# Altium schematic sheet 1_Schematic - OSSM Wireless V0.4.schdoc
size 1635 x 568 mm
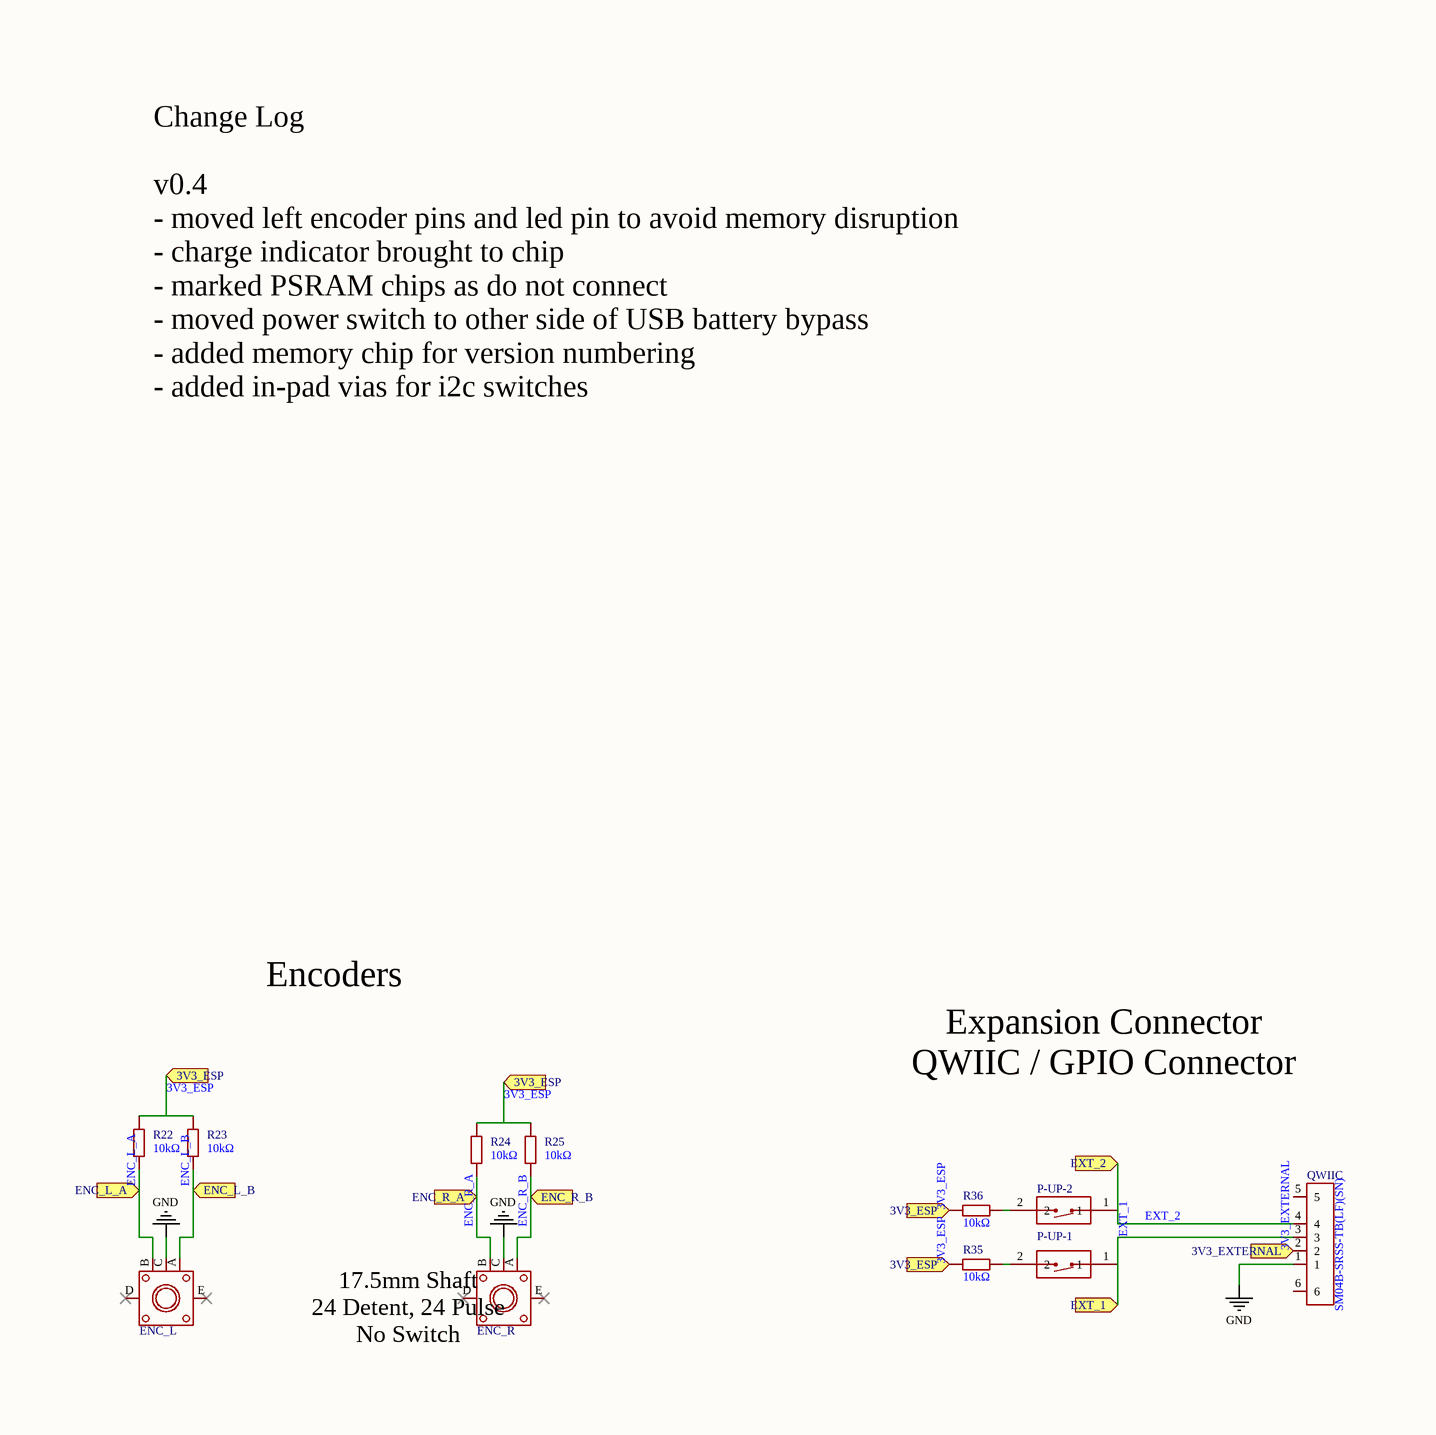
[diagram p0: 1_Schematic - OSSM Wireless V0.4.schdoc, top left]
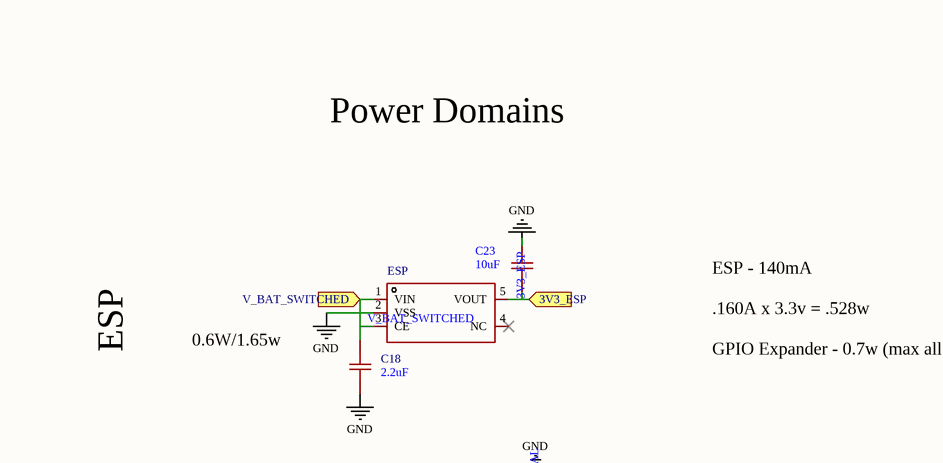
[diagram p1: 1_Schematic - OSSM Wireless V0.4.schdoc, top middle]
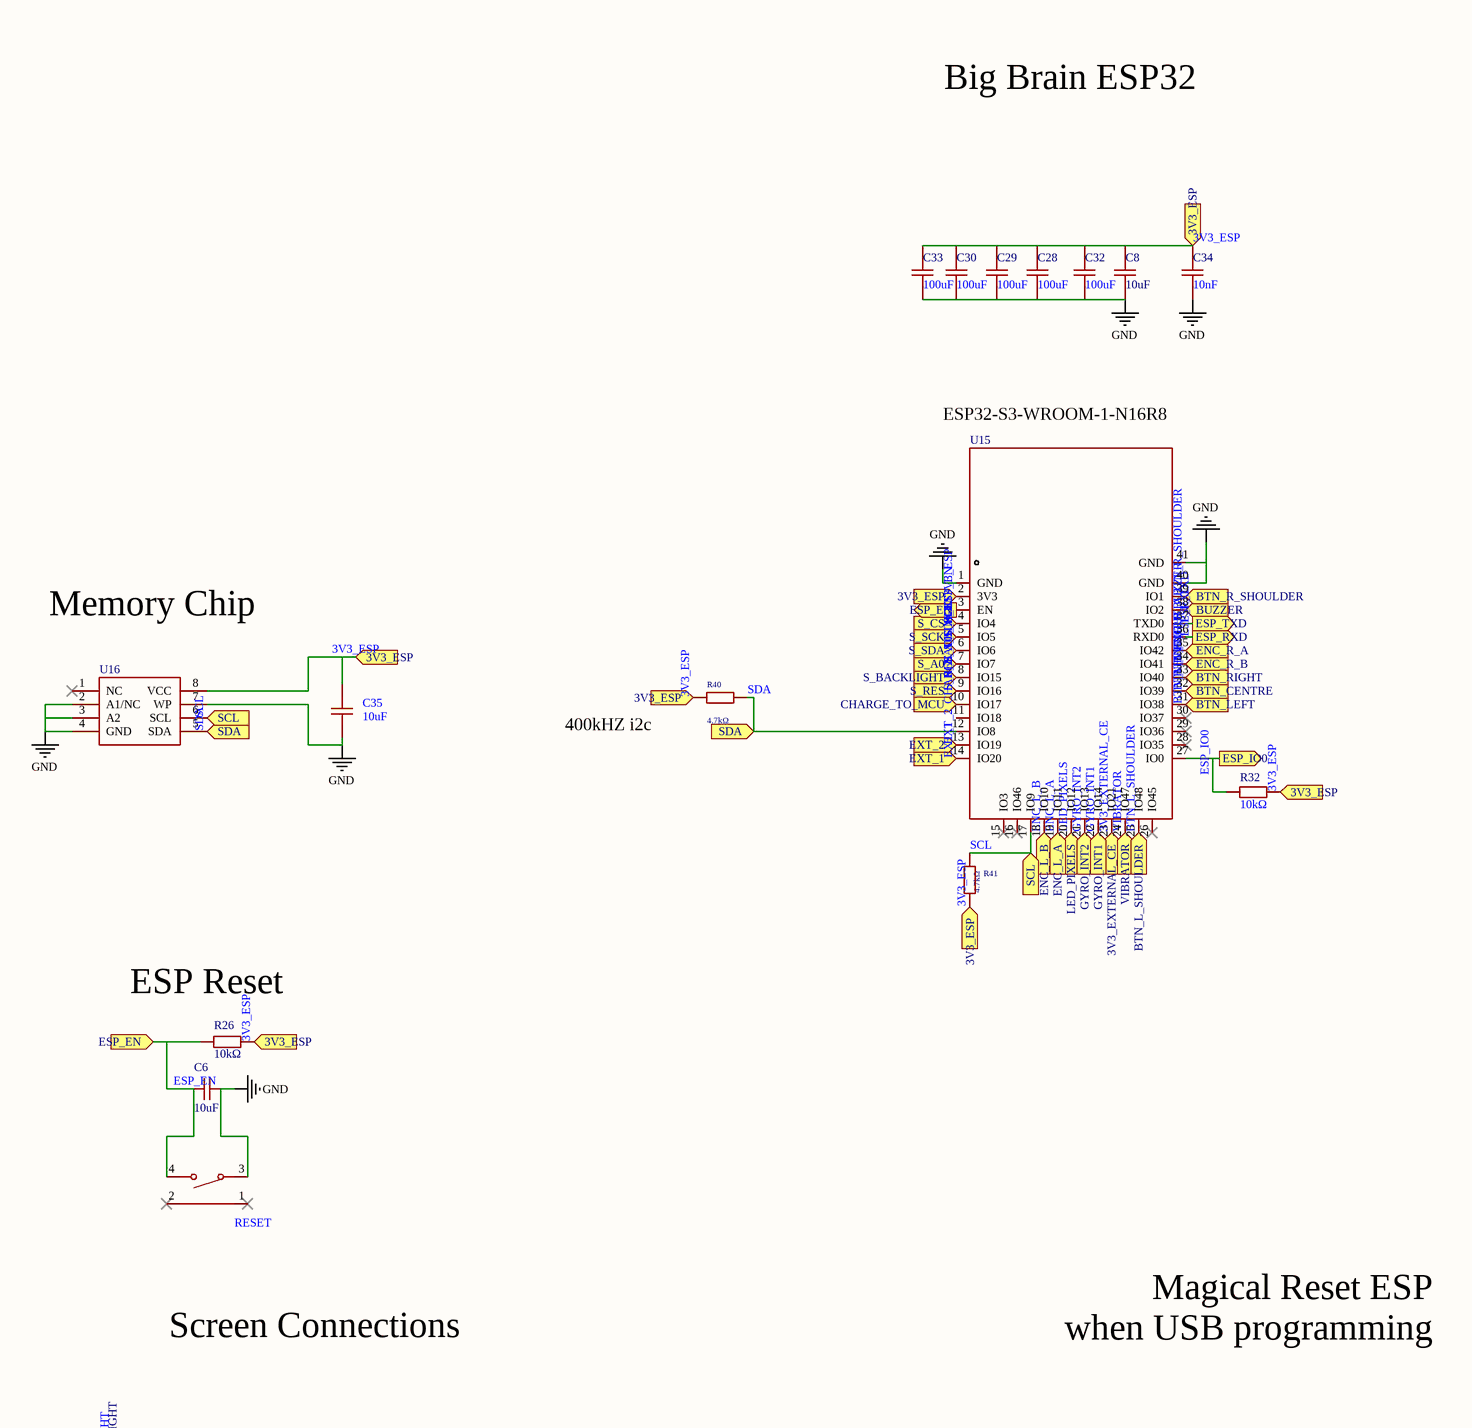
[diagram p2: 1_Schematic - OSSM Wireless V0.4.schdoc, top right]
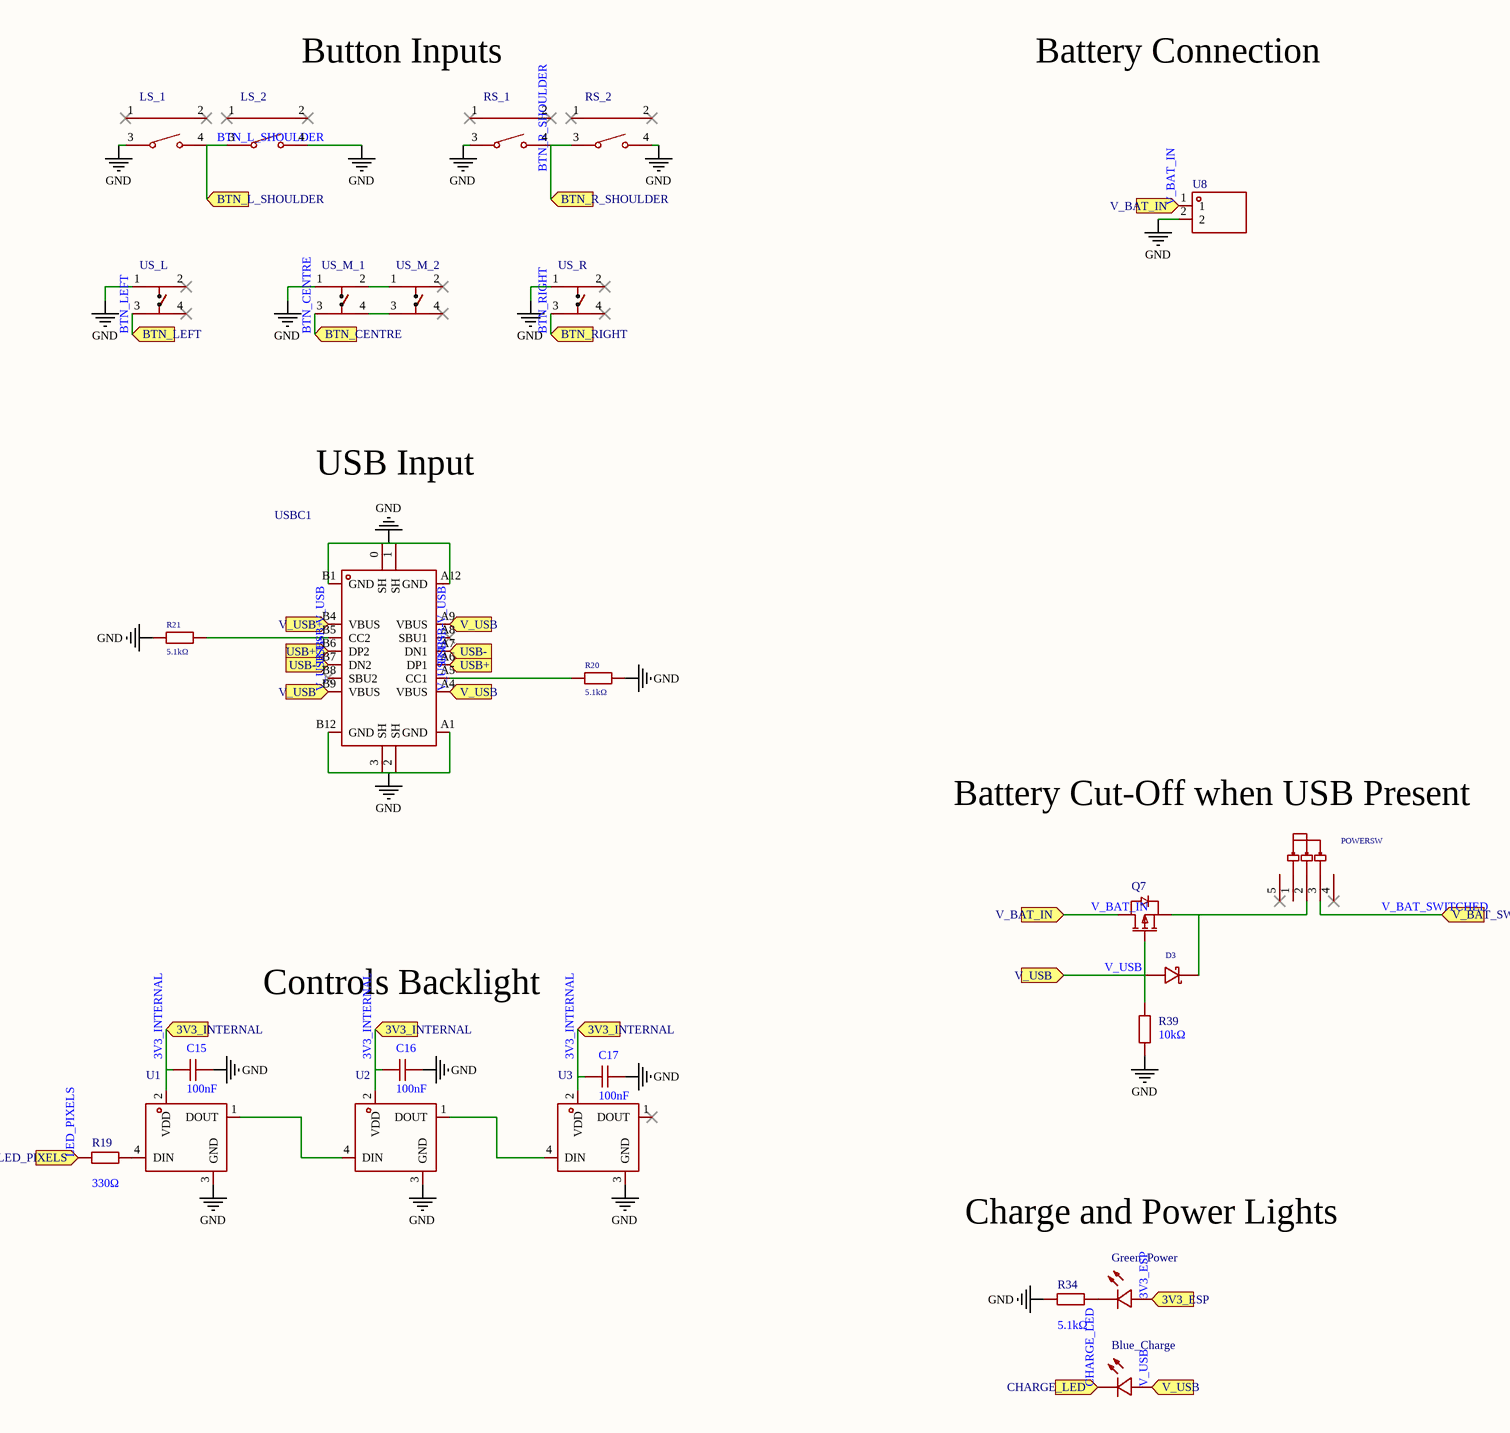
[diagram p3: 1_Schematic - OSSM Wireless V0.4.schdoc, bottom left]
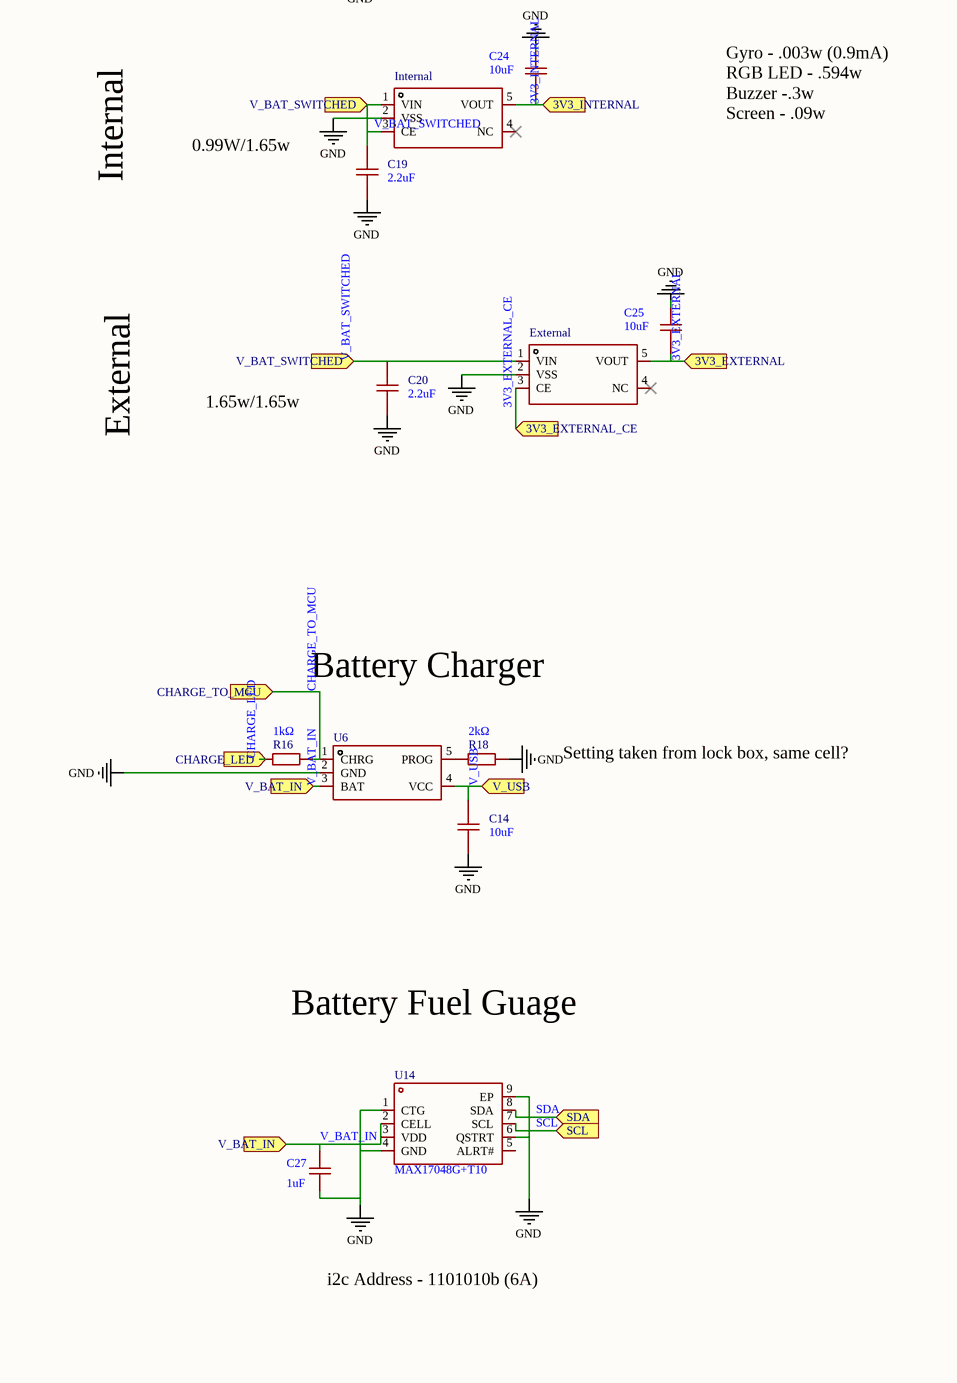
[diagram p4: 1_Schematic - OSSM Wireless V0.4.schdoc, bottom middle]
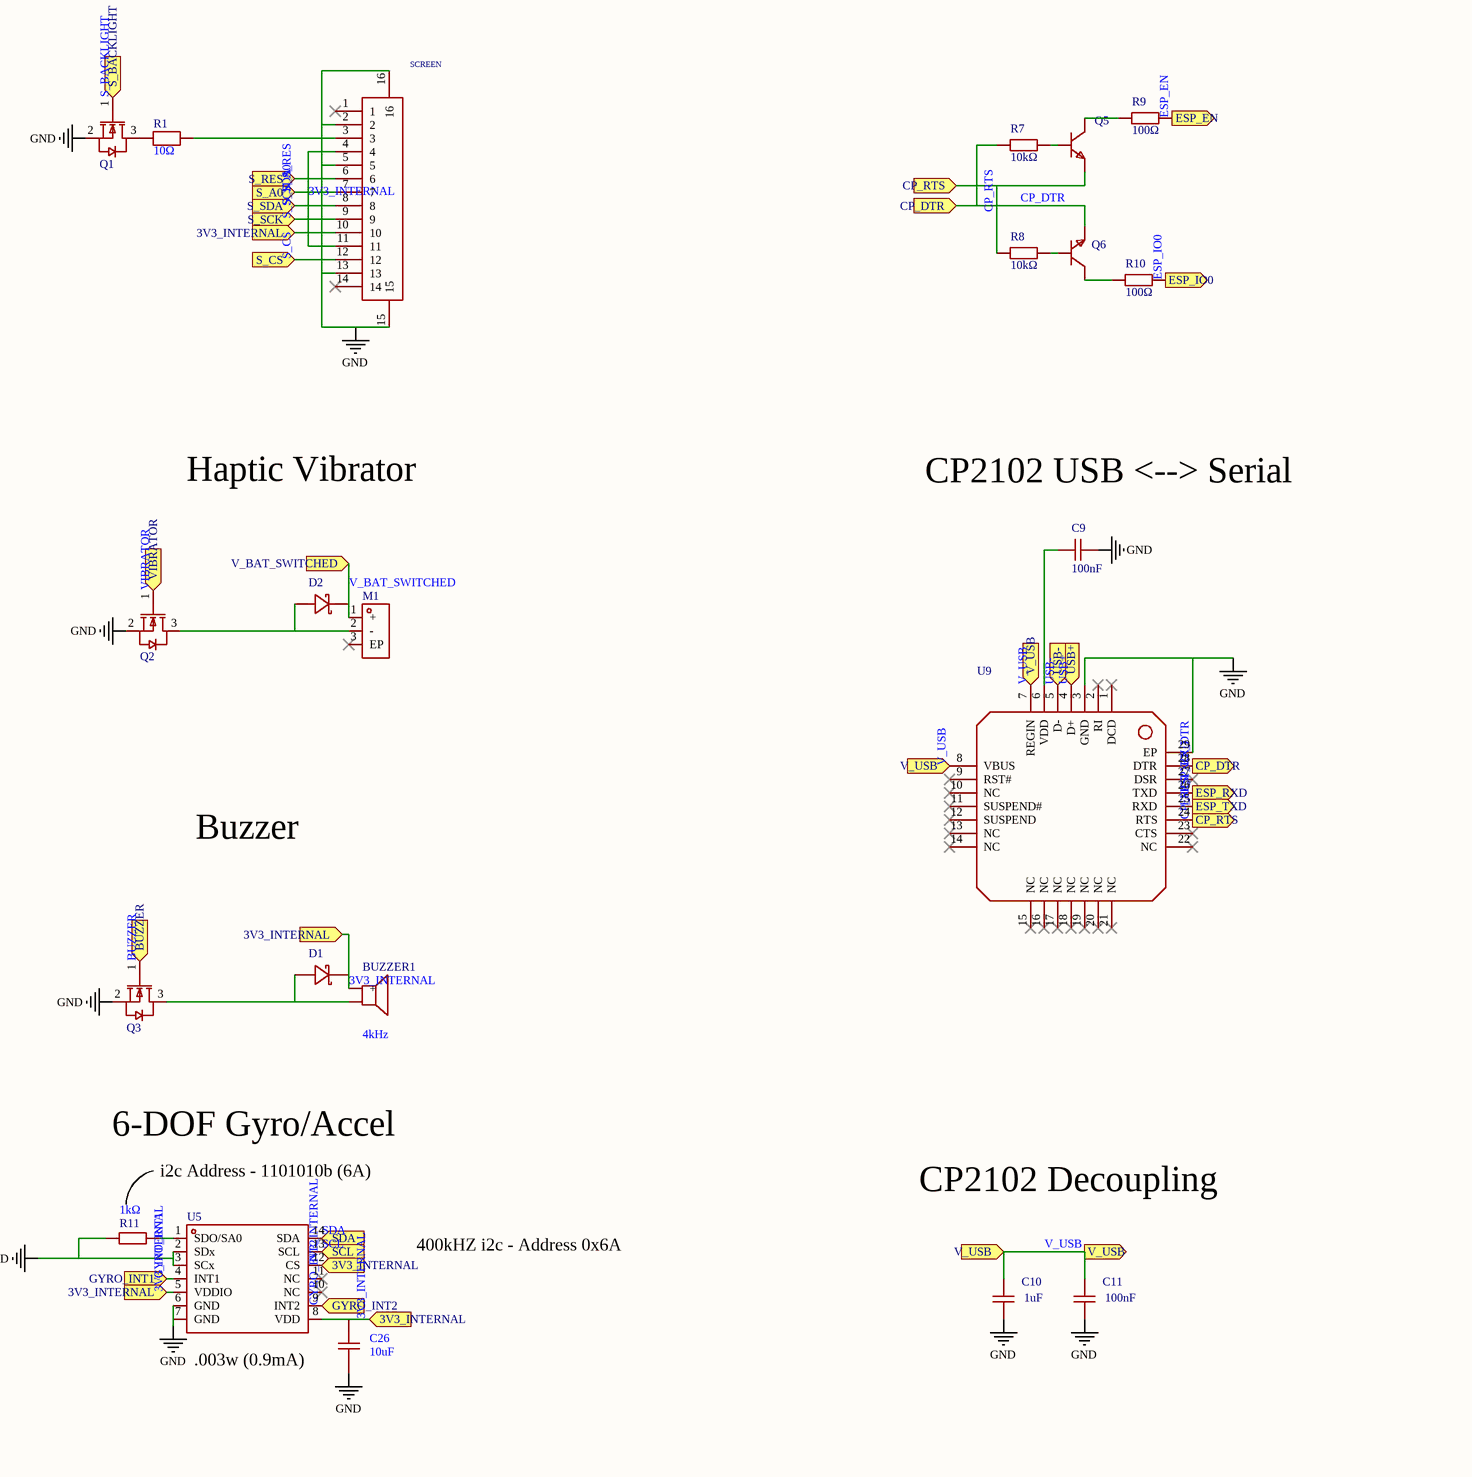
[diagram p5: 1_Schematic - OSSM Wireless V0.4.schdoc, bottom right]

## Parts
Blue_Charge  TJ-S1706SW6TGLC6B-A5  [LED-SMD_L1.7-W0.6-RD]  (value not drawn)
BUZZER1  4kHz  [BUZ-SMD_L4.0-W4.0-P3.50-L]
C6  value 10uF  [C0402]
C8  value 10uF  [C0402]
C9  100nF  [C0402]
C10  1uF  [C0402]
C11  100nF  [C0402]
C14  10uF  [C0402]
C15  100nF  [C0402]
C16  100nF  [C0402]
C17  100nF  [C0402]
C18  2.2uF  [C0402]
C19  2.2uF  [C0402]
C20  2.2uF  [C0402]
C23  value 10uF  [C0402]
C24  value 10uF  [C0402]
C25  value 10uF  [C0402]
C26  value 10uF  [C0402]
C27  1uF  [C0402]
C28  100uF  [C1206]
C29  100uF  [C1206]
C30  100uF  [C1206]
C32  100uF  [C1206]
C33  100uF  [C1206]
C34  10nF  [C0402]
C35  value 10uF  [C0402]
D1  B5819W  [SOD-123F_L2.7-W1.6-LS3.8-RD-1]  (value not drawn)
D2  B5819W  [SOD-123F_L2.7-W1.6-LS3.8-RD-1]  (value not drawn)
D3  B5819W-TP  [SOD-123_L2.8-W1.8-LS3.7-RD]  (value not drawn)
ENC_L  EC12E24204A8  [SW-TH_EC12EXXXX]  (value not drawn)
ENC_R  EC12E24204A8  [SW-TH_EC12EXXXX]  (value not drawn)
ESP  ME6211C33M5G-N  [SOT-23-5_L3.0-W1.7-P0.95-LS2.8-BL]  (value not drawn)
External  ME6211C33M5G-N  [SOT-23-5_L3.0-W1.7-P0.95-LS2.8-BL]  (value not drawn)
Green_Power  TJ-S1706SW6TGLC2G-A5  [LED-SMD_L1.7-W0.6-RD]  (value not drawn)
Internal  ME6211C33M5G-N  [SOT-23-5_L3.0-W1.7-P0.95-LS2.8-BL]  (value not drawn)
LS_1  TS24CA  [SW-SMD_TS24CA]  (value not drawn)
LS_2  TS24CA  [SW-SMD_TS24CA]  (value not drawn)
M1  Z3OC1T8219731  [VIBRATING-MOTOR-SMD_3P-C9900001680]  (value not drawn)
P-UP-1  2.54-1P TPGT  [SW-SMD_2P-L6.2-W2.5-LS9.4]  (value not drawn)
P-UP-2  2.54-1P TPGT  [SW-SMD_2P-L6.2-W2.5-LS9.4]  (value not drawn)
POWERSW  SK12D07VG5  [SW-TH_SK12D07VG5]  (value not drawn)
Q1  AO3400  [SOT-23_L2.9-W1.3-P1.90-LS2.4-BR]  (value not drawn)
Q2  AO3400  [SOT-23_L2.9-W1.3-P1.90-LS2.4-BR]  (value not drawn)
Q3  AO3400  [SOT-23_L2.9-W1.3-P1.90-LS2.4-BR]  (value not drawn)
Q5  (no value)  [SOT-23-3_L2.9-W1.3-P1.90-LS2.4-BR]
Q6  (no value)  [SOT-23-3_L2.9-W1.3-P1.90-LS2.4-BR]
Q7  SI2301  [SOT-23-3_L2.9-W1.4-P1.91-LS2.6-BR]  (value not drawn)
QWIIC  SM04B-SRSS-TB(LF)(SN)  [CONN-SMD_4P-P1.00_SM04B-SRSS-TB-LF-SN]
R1  10Ω  [R0603]
R7  value 10kΩ  [R0402]
R8  value 10kΩ  [R0402]
R9  100Ω  [R0402]
R10  100Ω  [R0402]
R11  1kΩ  [R0402]
R16  1kΩ  [R0402]
R18  2kΩ  [R0402]
R19  330Ω  [R0402]
R20  5.1kΩ  [R0402]
R21  5.1kΩ  [R0402]
R22  10kΩ  [R0402]
R23  10kΩ  [R0402]
R24  10kΩ  [R0402]
R25  10kΩ  [R0402]
R26  value 10kΩ  [R0402]
R32  10kΩ  [R0402]
R34  5.1kΩ  [R0402]
R35  10kΩ  [R0402]
R36  10kΩ  [R0402]
R39  10kΩ  [R0402]
R40  4.7kΩ  [R0402]
R41  4.7kΩ  [R0402]
RESET  TS24CA  [SW-SMD_TS24CA]  (value not drawn)
RS_1  TS24CA  [SW-SMD_TS24CA]  (value not drawn)
RS_2  TS24CA  [SW-SMD_TS24CA]  (value not drawn)
SCREEN  AFC01-S14FCA-00  [FPC-SMD_AFC01-S14FCA-00]  (value not drawn)
U1  XL-1010RGBC-WS2812B  [LED-SMD_4P-L1.0-W1.0-TL_XL-1010RGBC-WS2812B]  (value not drawn)
U2  XL-1010RGBC-WS2812B  [LED-SMD_4P-L1.0-W1.0-TL_XL-1010RGBC-WS2812B]  (value not drawn)
U3  XL-1010RGBC-WS2812B  [LED-SMD_4P-L1.0-W1.0-TL_XL-1010RGBC-WS2812B]  (value not drawn)
U5  LSM6DS3TR-C  [LGA-14_L3.0-W2.5-P0.50-TL]  (value not drawn)
U6  TP4054-42-SOT25R  [SOT-23-5_L3.0-W1.7-P0.95-LS2.8-BL]  (value not drawn)
U8  S2B-PH-K(LF)(SN)  [CONN-TH_S2B-PH-K-LF-SN]  (value not drawn)
U9  (no value)  [WQFN-28_L5.0-W5.0-P0.50-BL-EP3.2]
U14  MAX17048G+T10  [DFN-8_L2.0-W2.0-P0.50-BL-EP]
U15  ESP32-S3-WROOM-1-N16R8  [WIRELM-SMD_ESP32-S3-WROOM-1]  (value not drawn)
U16  AT24C04C-SSHM-T  [SOIC-8_L5.0-W4.0-P1.27-LS6.0-BL]  (value not drawn)
US_L  TC-6610-9-260G  [SW-TH_4P-L5.0-W5.0-P4.50-LS6.5]  (value not drawn)
US_M_1  TC-6610-9-260G  [SW-TH_4P-L5.0-W5.0-P4.50-LS6.5]  (value not drawn)
US_M_2  TC-6610-9-260G  [SW-TH_4P-L5.0-W5.0-P4.50-LS6.5]  (value not drawn)
US_R  TC-6610-9-260G  [SW-TH_4P-L5.0-W5.0-P4.50-LS6.5]  (value not drawn)
USBC1  TYPE-C-31-M-12  [USB-C_SMD-TYPE-C-31-M-12]  (value not drawn)

## Ports
3V3_ESP (in), 3V3_EXTERNAL (in), 3V3_EXTERNAL_CE (in), 3V3_INTERNAL (in), BTN_CENTRE (in), BTN_L_SHOULDER (in), BTN_LEFT (in), BTN_R_SHOULDER (in), BTN_RIGHT (in), BUZZER (in), CHARGE_LED (in), CHARGE_TO_MCU (in), CP_DTR (in), CP_DTR (out), CP_RTS (in), CP_RTS (out), ENC_L_A (in), ENC_L_B (in), ENC_R_A (in), ENC_R_B (in), ESP_EN (in), ESP_EN (out), ESP_IO0 (out), ESP_RXD (out), ESP_TXD (out), EXT_1 (in), EXT_2 (in), GYRO_INT1 (in), GYRO_INT2 (in), LED_PIXELS (in), S_A0 (in), S_BACKLIGHT (in), S_CS (in), S_RES (in), S_SCK (in), S_SDA (in), SCL (in), SDA (in), USB+ (in), USB- (in), V_BAT_IN (in), V_BAT_SWITCHED (in), V_USB (in), V_USB (out), VIBRATOR (in)

## Nets
GND: C6.2 C8.1 C9.1 C10.1 C11.1 C14.1 C15.2 C16.2 C17.2 C18.2 C19.2 C20.2 C23.1 C24.1 C25.1 C26.1 C27.1 C28.1 C29.1 C30.1 C32.1 C33.1 C34.1 C35.1 ENC_L.C ENC_R.C ESP.2(VSS) External.2(VSS) Internal.2(VSS) LS_1.3 LS_2.4 Q1.2(S) Q2.2(S) Q3.2(S) QWIIC.1 R11.1 R18.2 R20.2 R21.2 R34.1 R39.2 RESET.3 RS_1.3 RS_2.4 SCREEN.2 SCREEN.5 SCREEN.13 SCREEN.15 SCREEN.16 U1.3(GND) U2.3(GND) U3.3(GND) U5.2(SDx) U5.3(SCx) U5.6(GND) U5.7(GND) U6.2(GND) U8.2 U9.3(GND) U9.29(EP) U14.1(CTG) U14.4(GND) U14.6(QSTRT) U14.9(EP) U15.1(GND) U15.40(GND) U15.41(GND) U16.2(A1/NC) U16.3(A2) U16.4(GND) U16.7(WP) US_L.1 US_M_1.1 US_R.1 USBC1.0(SH) USBC1.1(SH) USBC1.2(SH) USBC1.3(SH) USBC1.A1(GND) USBC1.A12(GND) USBC1.B1(GND) USBC1.B12(GND)
3V3_ESP: C8.2 C23.2 C28.2 C29.2 C30.2 C32.2 C33.2 C34.2 C35.2 ESP.5(VOUT) Green_Power.2 R22.1 R23.1 R24.1 R25.1 R26.2 R32.2 R35.2 R36.2 R40.1 R41.1 U15.2(3V3) U16.8(VCC) ; port 3V3_ESP
3V3_EXTERNAL: C25.2 External.5(VOUT) QWIIC.2 ; port 3V3_EXTERNAL
3V3_EXTERNAL_CE: External.3(CE) U15.23(IO21) ; port 3V3_EXTERNAL_CE
3V3_INTERNAL: BUZZER1.1(+) C15.1 C16.1 C17.1 C24.2 C26.2 D1.1(K) Internal.5(VOUT) SCREEN.4 SCREEN.10 SCREEN.11 U1.2(VDD) U2.2(VDD) U3.2(VDD) U5.5(VDDIO) U5.8(VDD) U5.12(CS) ; port 3V3_INTERNAL
BTN_CENTRE: U15.32(IO39) US_M_1.3 ; port BTN_CENTRE
BTN_L_SHOULDER: LS_1.4 LS_2.3 U15.25(IO48) ; port BTN_L_SHOULDER
BTN_LEFT: U15.31(IO38) US_L.3 ; port BTN_LEFT
BTN_R_SHOULDER: RS_1.4 RS_2.3 U15.39(IO1) ; port BTN_R_SHOULDER
BTN_RIGHT: U15.33(IO40) US_R.3 ; port BTN_RIGHT
BUZZER: Q3.1(G) U15.38(IO2) ; port BUZZER
CHARGE_LED: Blue_Charge.1 R16.1 ; port CHARGE_LED
CHARGE_TO_MCU: R16.2 U6.1(CHRG) U15.10(IO17) ; port CHARGE_TO_MCU
CP_DTR: Q6.2(E) R7.1 U9.28(DTR) ; port CP_DTR
CP_RTS: Q5.2(E) R8.1 U9.24(RTS) ; port CP_RTS
ENC_L_A: ENC_L.B R22.2 U15.19(IO11) ; port ENC_L_A
ENC_L_B: ENC_L.A R23.2 U15.18(IO10) ; port ENC_L_B
ENC_R_A: ENC_R.B R24.2 U15.35(IO42) ; port ENC_R_A
ENC_R_B: ENC_R.A R25.2 U15.34(IO41) ; port ENC_R_B
ESP_EN: C6.1 R9.2 R26.1 RESET.4 U15.3(EN) ; port ESP_EN
ESP_IO0: R10.2 R32.1 U15.27(IO0) ; port ESP_IO0
ESP_RXD: U9.26(TXD) U15.36(RXD0) ; port ESP_RXD
ESP_TXD: U9.25(RXD) U15.37(TXD0) ; port ESP_TXD
EXT_1: P-UP-1.1 QWIIC.3 U15.14(IO20) ; port EXT_1
EXT_2: P-UP-2.1 QWIIC.4 U15.13(IO19) ; port EXT_2
GYRO_INT1: U5.4(INT1) U15.22(IO14) ; port GYRO_INT1
GYRO_INT2: U5.9(INT2) U15.21(IO13) ; port GYRO_INT2
LED_PIXELS: R19.1 U15.20(IO12) ; port LED_PIXELS
S_A0: SCREEN.7 U15.7(IO7) ; port S_A0
S_BACKLIGHT: Q1.1(G) U15.8(IO15) ; port S_BACKLIGHT
S_CS: SCREEN.12 U15.4(IO4) ; port S_CS
S_RES: SCREEN.6 U15.9(IO16) ; port S_RES
S_SCK: SCREEN.9 U15.5(IO5) ; port S_SCK
S_SDA: SCREEN.8 U15.6(IO6) ; port S_SDA
SCL: R41.2 U5.13(SCL) U14.7(SCL) U15.17(IO9) U16.6(SCL) ; port SCL
SDA: R40.2 U5.14(SDA) U14.8(SDA) U15.12(IO8) U16.5(SDA) ; port SDA
USB+: U9.4(D+) USBC1.A6(DP1) USBC1.B6(DP2) ; port USB+
USB-: U9.5(D-) USBC1.A7(DN1) USBC1.B7(DN2) ; port USB-
V_BAT_IN: C27.2 Q7.3(D) U6.3(BAT) U8.1 U14.2(CELL) U14.3(VDD) ; port V_BAT_IN
V_BAT_SWITCHED: C18.1 C19.1 C20.1 D2.1(K) ESP.1(VIN) ESP.3(CE) External.1(VIN) Internal.1(VIN) Internal.3(CE) M1.1(+) POWERSW.3 ; port V_BAT_SWITCHED
V_USB: Blue_Charge.2 C10.2 C11.2 C14.2 D3.2(A) Q7.1(G) R39.1 U6.4(VCC) U9.7(REGIN) U9.8(VBUS) USBC1.A4(VBUS) USBC1.A9(VBUS) USBC1.B4(VBUS) USBC1.B9(VBUS) ; port V_USB
VIBRATOR: Q2.1(G) U15.24(IO47) ; port VIBRATOR
NetBUZZER1_2: BUZZER1.2 D1.2(A) Q3.3(D)
NetC9_2: C9.2 U9.6(VDD)
NetD2_2: D2.2(A) M1.2(-) Q2.3(D)
NetD3_1: D3.1(C) POWERSW.2 Q7.2(S)
NetGreen_Power_1: Green_Power.1 R34.2
NetP-UP-1_2: P-UP-1.2 R35.1
NetP-UP-2_2: P-UP-2.2 R36.1
NetQ1_3: Q1.3(D) R1.1
NetQ5_1: Q5.1(B) R7.2
NetQ5_3: Q5.3(C) R9.1
NetQ6_1: Q6.1(B) R8.2
NetQ6_3: Q6.3(C) R10.1
NetR1_2: R1.2 SCREEN.3
NetR11_2: R11.2 U5.1(SDO/SA0)
NetR18_1: R18.1 U6.5(PROG)
NetR19_2: R19.2 U1.4(DIN)
NetR20_1: R20.1 USBC1.A5(CC1)
NetR21_1: R21.1 USBC1.B5(CC2)
NetU1_1: U1.1(DOUT) U2.4(DIN)
NetU2_1: U2.1(DOUT) U3.4(DIN)
NetUS_M_1_2: US_M_1.2 US_M_2.1
NetUS_M_1_4: US_M_1.4 US_M_2.3

Not connected (* = marked no-connect by the designer): ENC_L D* E*; ENC_R D* E*; ESP 4(NC)*; External 4(NC)*; Internal 4(NC)*; LS_1 1* 2*; LS_2 1* 2*; M1 3(EP)*; POWERSW 1 4* 5*; QWIIC 5 6; RESET 1* 2*; RS_1 1* 2*; RS_2 1* 2*; SCREEN 1* 14*; U3 1(DOUT)*; U5 10(NC)* 11(NC)*; U9 1(DCD)* 2(RI)* 9(RST#)* 10(NC)* 11(SUSPEND#)* 12(SUSPEND)* 13(NC)* 14(NC)* 15(NC)* 16(NC)* 17(NC)* 18(NC)* 19(NC)* 20(NC)* 21(NC)* 22(NC)* 23(CTS)* 27(DSR)*; U14 5(ALRT#); U15 11(IO18) 15(IO3)* 16(IO46)* 26(IO45)* 28(IO35)* 29(IO36)* 30(IO37)*; U16 1(NC)*; US_L 2* 4*; US_M_2 2* 4*; US_R 2* 4*; USBC1 A8(SBU1)* B8(SBU2)*

## Notes on the sheet
- Big Brain ESP32
- Change Log
  v0.4
  - moved left encoder pins and led pin to avoid memory disruption
  - charge indicator brought to chip
  - marked PSRAM chips as do not connect
  - moved power switch to other side of USB battery bypass
  - added memory chip for version numbering
  - added in-pad vias for i2c switches
- ESP32-S3-WROOM-1-N16R8
- Memory Chip
- (near R40) 400kHZ i2c
- (near R26) ESP Reset
- Encoders
- Power Domains
- Expansion Connector
- QWIIC / GPIO Connector
- ESP - 140mA
  .160A x 3.3v = .528w
  GPIO Expander - 0.7w (max all driven, will be lower)
- Magical Reset ESP
  when USB programming
- ESP
- Screen Connections
- 0.6W/1.65w
- (near ENC_R) 17.5mm Shaft
  24 Detent, 24 Pulse
  No Switch
- Gyro - .003w (0.9mA)
  RGB LED - .594w
  Buzzer -.3w
  Screen - .09w
- Internal
- 0.99W/1.65w
- Button Inputs
- Battery Connection
- External
- 1.65w/1.65w
- Haptic Vibrator
- CP2102 USB <--> Serial
- USB Input
- Battery Charger
- Setting taken from lock box, same cell?
- Buzzer
- Battery Cut-Off when USB Present
- Battery Fuel Guage
- Controls Backlight
- 6-DOF Gyro/Accel
- CP2102 Decoupling
- i2c Address - 1101010b (6A)
- 400kHZ i2c - Address 0x6A
- .003w (0.9mA)
- Charge and Power Lights

## Library data of the parts
Blue_Charge = TJ-S1706SW6TGLC6B-A5: Manufacturer: TOGIALED(统佳); Add into BOM: yes; Emitted Color: Blue; Symbol: TJ-S1706SW6TGLC6B-A5; Device: TJ-S1706SW6TGLC6B-A5; LCSC Part Name: 蓝灯; Supplier Part: C273617; Manufacturer Part: TJ-S1706SW6TGLC6B-A5; Supplier Footprint: 0603; JLCPCB Part Class: Extended Part; Datasheet: https://atta.szlcsc.com/upload/public/pdf/source/20180904/C273617_010B6E63EA0A9F3D2D95851617E75532.pdf; Supplier: LCSC; Convert to PCB: yes
BUZZER1 = FUET-4020: Manufacturer: FUET(福声科技); Add into BOM: yes; Driver Circuitry: Passive (external drive); Voltage - Supply: 2V~4V; Sound Pressure Level(SPL): 65dB; Symbol: FST-4020; Device: FUET-4020; LCSC Part Name: 电压 3V 频率 4KHZ; Supplier Part: C391027; Manufacturer Part: FUET-4020; Supplier Footprint: SMD,4x4mm; JLCPCB Part Class: Extended Part; Datasheet: https://atta.szlcsc.com/upload/public/pdf/source/20191031/C391027_1FC1E5FCD05180B5ABC7B83EB3465454.pdf; Supplier: LCSC; Convert to PCB: yes; Technology: Electromagnetic Type; Value: 4kHz; Length: 4mm; Width: 4mm; Height: 2.5mm
C6 C8 C23-C26 C35 = GRM155R61A106ME44D: Manufacturer: muRata(村田); Add into BOM: yes; Tolerance: ±20%; Voltage Rated: 10V; Temperature Coefficient: X5R; Symbol: GRM155R61A106ME44D; Device: GRM155R61A106ME44D; LCSC Part Name: 10uF ±20% 10V; Supplier Part: C77000; Manufacturer Part: GRM155R61A106ME44D; Supplier Footprint: 0402; JLCPCB Part Class: Extended Part; Datasheet: https://atta.szlcsc.com/upload/public/pdf/source/20180530/C77000_4866797CFE3A842CD03C597EBD6AE6CD.pdf; Supplier: LCSC; Convert to PCB: yes
C9 C11 C15-C17 = CL05A104KA5NNNC: Manufacturer: SAMSUNG(三星); Symbol: 0402X104K250CT; Add into BOM: yes; Tolerance: ±10%; Device: CL05A104KA5NNNC; LCSC Part Name: 100nF ±10% 25V; Supplier Part: C100072; Manufacturer Part: CL05A104KA5NNNC; Supplier Footprint: 0402; JLCPCB Part Class: Extended Part; Datasheet: https://atta.szlcsc.com/upload/public/pdf/source/20160218/1457707763339.pdf; Supplier: LCSC; Convert to PCB: yes; Value: 100nF
C10 C27 = CL05A105KA5NQNC: Manufacturer: SAMSUNG(三星); Symbol: GRM155R61E105KA12D; Add into BOM: yes; Tolerance: ±10%; Device: CL05A105KA5NQNC; LCSC Part Name: 1uF ±10% 25V; Supplier Part: C52923; Manufacturer Part: CL05A105KA5NQNC; Supplier Footprint: 0402; JLCPCB Part Class: Basic Part; Datasheet: https://atta.szlcsc.com/upload/public/pdf/source/20160218/1457707763339.pdf; Supplier: LCSC; Convert to PCB: yes; Value: 1uF
C14 = CL05A106MP5NUNC_C315248: Manufacturer: SAMSUNG(三星); Add into BOM: yes; Tolerance: ±20%; Symbol: CL05A106MP5NUNC_C315248; Device: CL05A106MP5NUNC_C315248; LCSC Part Name: 10uF ±20% 10V; Supplier Part: C315248; Manufacturer Part: CL05A106MP5NUNC; Supplier Footprint: 0402; JLCPCB Part Class: Extended Part; Datasheet: https://atta.szlcsc.com/upload/public/pdf/source/20231220/1EF805BAE1520675928CC4638D279E74.pdf; Supplier: LCSC; Convert to PCB: yes; Value: 10uF
C18-C20 = CL05A225KO5NQNC: Manufacturer: SAMSUNG(三星); Add into BOM: yes; Tolerance: ±10%; Symbol: CL05A225KO5NQNC; Device: CL05A225KO5NQNC; LCSC Part Name: 2.2uF ±10% 16V; Supplier Part: C170151; Manufacturer Part: CL05A225KO5NQNC; Supplier Footprint: 0402; JLCPCB Part Class: Extended Part; Datasheet: https://atta.szlcsc.com/upload/public/pdf/source/20160218/1457707763339.pdf; Supplier: LCSC; Convert to PCB: yes; Value: 2.2uF
C28-C30 C32 C33 = GRM31CR60J107ME39L: Manufacturer: muRata(村田); Add into BOM: yes; Tolerance: ±20%; Symbol: GRM31CR60J107ME39L; Device: GRM31CR60J107ME39L; LCSC Part Name: 100uF ±20% 6.3V; Supplier Part: C77085; Manufacturer Part: GRM31CR60J107ME39L; Supplier Footprint: 1206; JLCPCB Part Class: Extended Part; Datasheet: https://atta.szlcsc.com/upload/public/pdf/source/20190118/C77085_EB63EA4314148F1F6834EDA28DC8EAB4.pdf; Supplier: LCSC; Convert to PCB: yes; Value: 100uF
C34 = CC0402KRX7R5BB103: Manufacturer: YAGEO(国巨); Add into BOM: yes; Tolerance: ±10%; Symbol: CC0402KRX7R5BB103; Device: CC0402KRX7R5BB103; LCSC Part Name: 10nF ±10% 6.3V; Supplier Part: C541370; Manufacturer Part: CC0402KRX7R5BB103; Supplier Footprint: 0402; JLCPCB Part Class: Extended Part; Datasheet: https://atta.szlcsc.com/upload/public/pdf/source/20200615/C541370_B843B3A08EFF7F6723E2927D1FB238F8.pdf; Supplier: LCSC; Convert to PCB: yes; Value: 10nF
D1 D2 = B5819W_C2943878: Manufacturer: GOODWORK(固得沃克); Add into BOM: yes; Diode Configuration: Independent Type; Voltage - Forward(Vf@If): 580mV@1A; Voltage - DC Reverse(Vr): 40V; Current - Rectified: 1A; Reverse Leakage Current (Ir): 50uA; Symbol: B5819W_C2943878; Device: B5819W_C2943878; LCSC Part Name: 电压:40V 电流:1A; Supplier Part: C2943878; Manufacturer Part: B5819W; Supplier Footprint: SOD-123; JLCPCB Part Class: Extended Part; Datasheet: https://atta.szlcsc.com/upload/public/pdf/source/20240805/2CC18A805369F116C1ABD2634D29579F.pdf; Supplier: LCSC; Convert to PCB: yes
D3 = B5819W-TP: Manufacturer: MCC(美微科); Add into BOM: yes; Forward Voltage (Vf@If): 600mV@1A; Reverse Voltage (Vr): 40V; Average Rectified Current (Io): 1A; Reverse Leakage Current (Ir): 1mA@40V; Symbol: B5819W-TP; Device: B5819W-TP; Supplier: LCSC; Manufacturer Part: B5819W-TP; Supplier Part: C84354; JLCPCB Part Class: Extended Part; LCSC Part Name: 电压:40V 电流:1A; Supplier Footprint: SOD-123; Datasheet: https://atta.szlcsc.com/upload/public/pdf/source/20161112/1478931641987.pdf; Convert to PCB: yes; Diode Configuration: -
ENC_L ENC_R = EC12E24204A8: Manufacturer: ALPSALPINE(阿尔卑斯阿尔派); Symbol: EC12E24204A7; Add into BOM: yes; Device: EC12E24204A8; LCSC Part Name: EC12E24204A8; Supplier Part: C470598; Manufacturer Part: EC12E24204A8; Supplier Footprint: 插件; JLCPCB Part Class: Extended Part; Datasheet: https://atta.szlcsc.com/upload/public/pdf/source/20191216/C470767_B5E3E3E7653450822FC0F511F0CCD1DA.pdf; Supplier: LCSC; Convert to PCB: yes
ESP External Internal = ME6211C33M5G-N: Manufacturer: MICRONE(南京微盟); Add into BOM: yes; Output Type: Fixed; Voltage - Supply: 6V; Output Voltage: 3.3V; Output Current: 500mA; Power Supply Rejection Ratio (PSRR): 70dB@(1kHz)；62dB@(10kHz); Voltage Dropout: 260mV@(200mA); Output Configuration: Positive electrode; Number of Outputs: 1; Symbol: ME6211C33M5G-N; Device: ME6211C33M5G-N; LCSC Part Name: 输入6V 输出3.3V 500mA; Supplier Part: C82942; Manufacturer Part: ME6211C33M5G-N; Supplier Footprint: SOT-23-5; JLCPCB Part Class: Extended Part; Datasheet: https://atta.szlcsc.com/upload/public/pdf/source/20170918/C82942_1505727073070976520.pdf; Supplier: LCSC; Convert to PCB: yes; Features: Short-Circuit  Protection(SCP)；Low ESR；Overcurrent Protection(OCP)；With ability
Green_Power = TJ-S1706SW6TGLC2G-A5: Manufacturer: TOGIALED(统佳); Add into BOM: yes; Emitted Color: Emerald; Forward Voltage (VF): 2.8V~3.4V; Viewing Angle: 120°; Mounting Sytle: Side sticker; Symbol: TJ-S1706SW6TGLC2G-A5; Device: TJ-S1706SW6TGLC2G-A5; LCSC Part Name: 翠绿; Supplier Part: C273616; Manufacturer Part: TJ-S1706SW6TGLC2G-A5; Supplier Footprint: 0603; JLCPCB Part Class: Extended Part; Datasheet: https://atta.szlcsc.com/upload/public/pdf/source/20180904/C273616_3602F4453E26E183143E94C3FB159149.pdf; Supplier: LCSC; Convert to PCB: yes; Operating Temperature: -40℃~+80℃
LS_1 LS_2 RESET RS_1 RS_2 = TS24CA: Manufacturer: SHOU HAN(首韩); Add into BOM: yes; Circuit: SPST; Actuator Style: Rectangle button; Switch Length: 4.55mm; Switch Width: 1.8mm; Switch Height: 3.5mm; Contact Current: 50mA; Voltage Rating (DC): 12V; Symbol: TS24CA; Device: TS24CA; LCSC Part Name: 4.55*1.8*3.5mm 卧贴 轻触开关; Supplier Part: C393942; Manufacturer Part: TS24CA; Supplier Footprint: SMD; JLCPCB Part Class: Extended Part; Datasheet: https://atta.szlcsc.com/upload/public/pdf/source/20190521/C393942_591A9E318887EFA4274D34029981AD99.pdf; Supplier: LCSC; Convert to PCB: yes; Mounting Style: 卧贴; With Lamp: -; Mechanical Life: -
M1 = Z3OC1T8219731: Manufacturer: KOTL(金龙机电); Add into BOM: yes; Voltage Rating: 2.7V; Current Rating: 85mA; Rated Speed: 14000±2500rpm; Sense Of Rotation: CW; Symbol: Z3OC1T8219731; Device: Z3OC1T8219731; LCSC Part Name: Z3OC1T8219731; Supplier Part: C2894731; Manufacturer Part: Z3OC1T8219731; Supplier Footprint: -; JLCPCB Part Class: Extended Part; Datasheet: https://atta.szlcsc.com/upload/public/pdf/source/20210908/21604D4C77F5141C93AFC2CF1DCB74B9.pdf; Supplier: LCSC; Convert to PCB: yes; Type: Cylindrical DC Motor; Operating Temperature: -20℃~+70℃
P-UP-1 P-UP-2 = 2.54-1P TPGT: Manufacturer: SHOU HAN(首韩); Add into BOM: yes; Circuit: SPST; Number of Positions: 1 Digit; Current Rating: 25mA; Voltage Rating: 24V; Operating Life: 3000 times; Symbol: 2.54-1P TPGT; Device: 2.54-1P TPGT; LCSC Part Name: 间距2.54mm 1位高推 拨码开关 贴片; Supplier Part: C7421519; Manufacturer Part: 2.54-1P TPGT; Supplier Footprint: SMD; JLCPCB Part Class: Extended Part; Datasheet: https://atta.szlcsc.com/upload/public/pdf/source/20240424/3BA8A8721B8DEF6B83DCA7043BA47676.pdf; Supplier: LCSC; Convert to PCB: yes; Type: Flat Toggle, Raised Style; Lead Pitch: 2.54mm; Color: Black
POWERSW = SK12D07VG5: Manufacturer: SHOU HAN(首韩); Add into BOM: yes; Circuit: SPDT; Pin Style: PCPin; Switch Length: 8.7mm; Switch Width: 4.4mm; Switch Height: 4.7mm; Current Rating (DC): 500mA; Voltage Rating (DC): 50V; Mechanical Life: 5千次; Symbol: SK12D07VG5; Device: SK12D07VG5; Supplier: LCSC; Supplier Part: C431548; Manufacturer Part: SK12D07VG5; JLCPCB Part Class: Extended Part; LCSC Part Name: 两档位卧式拨动开关,柄长5MM; Supplier Footprint: 插件; Datasheet: https://atta.szlcsc.com/upload/public/pdf/source/20190925/C431548_D6571AEBDE139FDB1E6F8A4B1513A630.pdf; Convert to PCB: yes; Actuator Style: -; Mounting Style: 侧插; Actuator Color: -; Current Rating (AC): -; Voltage Rating (AC): -; Operating Temperature: -10℃~+50℃
Q1-Q3 = AO3400_C2938367: Manufacturer: GOODWORK(固得沃克); Add into BOM: yes; Type: 1 N-channel; Drain to Source Voltage: 30V; Current - Continuous Drain(Id): 5.8A; RDS(on): 52mΩ@2.5V,4A; Pd - Power Dissipation: 1.5W; Gate Threshold Voltage (Vgs(th)@Id): 700mV; Input Capacitance(Ciss@Vds): 1.05nF; Reverse Transfer Capacitance (Crss@Vds): 77pF; Symbol: AO3400_C2938367; Device: AO3400_C2938367; LCSC Part Name: 1个N沟道 耐压:30V 电流:5.8A; Supplier Part: C2938367; Manufacturer Part: AO3400; Supplier Footprint: SOT-23; JLCPCB Part Class: Extended Part; Datasheet: https://atta.szlcsc.com/upload/public/pdf/source/20240805/AF56525E67E43DBB802F95DDDF058BE9.pdf; Supplier: LCSC; Convert to PCB: yes; Gate Charge(Qg): -; Operating Temperature: -55℃~+150℃
Q5 Q6 = BC817: Manufacturer: CJ（江苏长电/长晶）; Symbol: BC817-16 6A; Add into BOM: yes; Transistor Type: NPN; Collector-Emitter Breakdown Voltage (Vceo): 45V; Collector Current (Ic): 500mA; Power Dissipation (Pd): 300mW; Collector-Emitter Saturation Voltage (VCE(sat)@Ic,Ib): 700mV@500mA,50mA; DC Current Gain (hFE@Ic,Vce): 100@100mA,1V; Transition Frequency (fT): 100MHz; Device: BC817; LCSC Part Name: BC817-16; Supplier Part: C2137; Manufacturer Part: BC817; Supplier Footprint: SOT-23(SOT-23-3); JLCPCB Part Class: Extended Part; Datasheet: https://atta.szlcsc.com/upload/public/pdf/source/20140809/1457707208989.pdf; Supplier: LCSC; Convert to PCB: yes; Operating Temperature: +150@(Tj)
Q7 = SI2301_C727151: Manufacturer: TWGMC(台湾迪嘉); Add into BOM: yes; Type: 1 Piece P-Channel; Drain Source On Resistance (RDS(on)@Vgs,Id): 112mΩ@4.5V,2.8A; Input Capacitance (Ciss@Vds): 405pF@10V; Reverse Transfer Capacitance (Crss@Vds): 55pF@10V; Symbol: SI2301_C727151; Device: SI2301_C727151; LCSC Part Name: 1个P沟道 耐压:20V 电流:2.8A; Supplier Part: C727151; Manufacturer Part: SI2301; Supplier Footprint: SOT-23; JLCPCB Part Class: Extended Part; Datasheet: https://atta.szlcsc.com/upload/public/pdf/source/20200827/C727151_305C77401298A97EBFD5A496568D8C6C.pdf; Supplier: LCSC; Convert to PCB: yes; Total Gate Charge (Qg@Vgs): -
QWIIC = SM04B-SRSS-TB(LF)(SN): Manufacturer: JST; Add into BOM: yes; Pins Structure: 1x4P; Pitch: 1mm; Reference Series: SH; Number of PINs Per Row: 4; Current Rating (Max): 1A; Rated Voltage (Max): 50V; Plastic Material: PA; Flame Retardant Rating: UL94V-0; Supplementary Features: Auxiliary soldering legs; Z-Height of the Board: 2.9mm; X-Length of Bottom Edge on Board (Spacing Line): 6mm; Y-Width of Bottom Edge on Board: 4.32mm; Symbol: SM04B-SRSS-TB (LF)(SN); Device: SM04B-SRSS-TB(LF)(SN); LCSC Part Name: 1x4P 间距:1mm 卧贴 系列:SH; Supplier Part: C160404; Manufacturer Part: SM04B-SRSS-TB(LF)(SN); Supplier Footprint: SMD,P=1mm,卧贴; JLCPCB Part Class: Extended Part; Datasheet: https://atta.szlcsc.com/upload/public/pdf/source/20181010/C265335_7D2AD766CA0E20E745663C87507A223E.pdf; Supplier: LCSC; Convert to PCB: yes; Mounting Style: Horizontal attachment; Number of Pins: 4P; Number of Rows: 1; Row Spacing: -; Contact Material: Copper alloy; Contact Plating: Tin; Operating Temperature Range: -25℃~+85℃; Colour: White
R1 = PS03W4F100JT5E: Manufacturer: UNI-ROYAL(厚声); Add into BOM: yes; Tolerance: ±1%; Temperature Coefficient: ±100ppm/℃; Symbol: PS03W4F100JT5E; Device: PS03W4F100JT5E; LCSC Part Name: 10Ω ±1% 250mW 厚膜电阻; Supplier Part: C2784884; Manufacturer Part: PS03W4F100JT5E; Supplier Footprint: 0603; JLCPCB Part Class: Extended Part; Datasheet: https://atta.szlcsc.com/upload/public/pdf/source/20210330/C2758625_90D19EEA9B8C23AA9BAF71D52BD1DB3E.pdf; Supplier: LCSC; Convert to PCB: yes; Type: Thick Film Resistors; Value: 10Ω; Operating Temperature Range: -55℃~+155℃
R7 R8 R26 = WR04X1002FTL: Manufacturer: 华新科(Walsin); Add into BOM: yes; Tolerance: ±1%; Power(Watts): 1/16W; Temperature Coefficient: ±100ppm/; Overload Voltage (Max): 50V; Symbol: WR04X1002FTL; Device: WR04X1002FTL; LCSC Part Name: 10kΩ ±1% 1/16W; Supplier Part: C163810; Manufacturer Part: WR04X1002FTL; Supplier Footprint: 0402; JLCPCB Part Class: Extended Part; Datasheet: https://atta.szlcsc.com/upload/public/pdf/source/20180228/C163810_15198053310761377184.pdf; Supplier: LCSC; Convert to PCB: yes; Operating Temperature Range: -55~+155
R9 R10 = RC0402FR-07100RL: Manufacturer: YAGEO(国巨); Symbol: AECR0402F100RK9; Add into BOM: yes; Tolerance: ±1%; Temperature Coefficient: ±100ppm/℃; Device: RC0402FR-07100RL; LCSC Part Name: 厚膜电阻 100Ω ±1% 62.5mW; Supplier Part: C106232; Manufacturer Part: RC0402FR-07100RL; Supplier Footprint: 0402; JLCPCB Part Class: Extended Part; Datasheet: https://atta.szlcsc.com/upload/public/pdf/source/20180927/C295883_E8D83085EA81BD7DE0B2B681138C15EE.pdf; Supplier: LCSC; Convert to PCB: yes; Type: Thick Film Resistors; Value: 100Ω; Operating Temperature Range: -55℃~+155℃
R11 R16 = RC0402FR-071KL: Manufacturer: YAGEO(国巨); Add into BOM: yes; Tolerance: ±1%; Temperature Coefficient: ±100ppm/℃; Symbol: RC0402FR-071KL; Device: RC0402FR-071KL; LCSC Part Name: 厚膜电阻 1kΩ ±1% 62.5mW; Supplier Part: C106235; Manufacturer Part: RC0402FR-071KL; Supplier Footprint: 0402; JLCPCB Part Class: Extended Part; Datasheet: https://atta.szlcsc.com/upload/public/pdf/source/20180927/C295883_E8D83085EA81BD7DE0B2B681138C15EE.pdf; Supplier: LCSC; Convert to PCB: yes; Type: Thick Film Resistors; Value: 1kΩ; Operating Temperature Range: -55℃~+155℃
R18 = RC0402FR-072KL: Manufacturer: YAGEO(国巨); Add into BOM: yes; Tolerance: ±1%; Temperature Coefficient: ±100ppm/℃; Symbol: RC0402FR-072KL; Device: RC0402FR-072KL; LCSC Part Name: 厚膜电阻 2kΩ ±1% 62.5mW; Supplier Part: C60488; Manufacturer Part: RC0402FR-072KL; Supplier Footprint: 0402; JLCPCB Part Class: Extended Part; Datasheet: https://atta.szlcsc.com/upload/public/pdf/source/20180821/C275644_0D56F95EFF785E7D9A1FEF436B37DA78.pdf; Supplier: LCSC; Convert to PCB: yes; Type: Thick Film Resistors; Value: 2kΩ; Operating Temperature Range: -55℃~+155℃
R19 = RC0402FR-07330RL: Manufacturer: YAGEO(国巨); Add into BOM: yes; Tolerance: ±1%; Temperature Coefficient: ±100ppm/℃; Symbol: RC0402FR-07330RL; Device: RC0402FR-07330RL; LCSC Part Name: 厚膜电阻 330Ω ±1% 62.5mW; Supplier Part: C105875; Manufacturer Part: RC0402FR-07330RL; Supplier Footprint: 0402; JLCPCB Part Class: Extended Part; Datasheet: https://atta.szlcsc.com/upload/public/pdf/source/20180821/C275644_0D56F95EFF785E7D9A1FEF436B37DA78.pdf; Supplier: LCSC; Convert to PCB: yes; Type: Thick Film Resistors; Value: 330Ω; Operating Temperature Range: -55℃~+155℃
R20 R21 = 0402WGF5101TCE: Manufacturer: UNI-ROYAL(厚声); Add into BOM: yes; Tolerance: ±1%; Temperature Coefficient: ±100ppm/℃; Symbol: 0402WGF5101TCE; Device: 0402WGF5101TCE; Supplier: LCSC; Manufacturer Part: 0402WGF5101TCE; Supplier Part: C25905; Value: 5.1kΩ; JLCPCB Part Class: Basic Part; LCSC Part Name: 5.1kΩ ±1% 62.5mW 厚膜电阻; Supplier Footprint: 0402; Datasheet: https://atta.szlcsc.com/upload/public/pdf/source/20200306/C422600_1E6D84923E4A46A82E41ADD87F860B5C.pdf; Convert to PCB: yes; Type: Thick Film Resistors; Operating Temperature Range: -55℃~+155℃
R22-R25 R32 R35 R36 R39 = RC0402FR-0710KL: Manufacturer: YAGEO(国巨); Add into BOM: yes; Tolerance: ±1%; Temperature Coefficient: ±100ppm/℃; Symbol: RC0402FR-0710KL; Device: RC0402FR-0710KL; LCSC Part Name: 厚膜电阻 10kΩ ±1% 62.5mW; Supplier Part: C60490; Manufacturer Part: RC0402FR-0710KL; Supplier Footprint: 0402; JLCPCB Part Class: Extended Part; Datasheet: https://atta.szlcsc.com/upload/public/pdf/source/20170925/C131467_1506321478108990263.pdf; Supplier: LCSC; Convert to PCB: yes; Type: Thick Film Resistors; Value: 10kΩ; Operating Temperature Range: -55℃~+155℃
R34 = RC0402FR-075K1L: Manufacturer: YAGEO(国巨); Add into BOM: yes; Tolerance: ±1%; Temperature Coefficient: ±100ppm/℃; Symbol: RC0402FR-075K1L; Device: RC0402FR-075K1L; LCSC Part Name: 厚膜电阻 5.1kΩ ±1% 62.5mW; Supplier Part: C105872; Manufacturer Part: RC0402FR-075K1L; Supplier Footprint: 0402; JLCPCB Part Class: Extended Part; Datasheet: https://atta.szlcsc.com/upload/public/pdf/source/20180821/C275644_0D56F95EFF785E7D9A1FEF436B37DA78.pdf; Supplier: LCSC; Convert to PCB: yes; Type: Thick Film Resistors; Value: 5.1kΩ; Operating Temperature Range: -55℃~+155℃
R40 R41 = 0402WGJ0472TCE: Manufacturer: UNI-ROYAL(厚声); Add into BOM: yes; Tolerance: ±5%; Power(Watts): 62.5mW; Voltage-Supply(Max): 50V; Temperature Coefficient: ±100ppm/℃; Symbol: 0402WGJ0472TCE; Device: 0402WGJ0472TCE; Supplier: LCSC; Manufacturer Part: 0402WGJ0472TCE; Supplier Part: C25940; Value: 4.7kΩ; JLCPCB Part Class: Extended Part; LCSC Part Name: 4.7kΩ ±5% 62.5mW 厚膜电阻; Supplier Footprint: 0402; Datasheet: https://item.szlcsc.com/datasheet/0402WGJ0472TCE/26683.html; Convert to PCB: yes; Type: Thick Film Resistor; Operating Temperature: -55℃~+155℃
SCREEN = AFC01-S14FCA-00: Manufacturer: JS(钜硕电子); Add into BOM: yes; Locking Feature: Clamshell; Number of Contacts: 14P; Pitch: 0.5mm; FFC, FCB Thickness: 0.3mm; Symbol: AFC01-S14FCA-00; Device: AFC01-S14FCA-00; Supplier: LCSC; Supplier Part: C262663; Manufacturer Part: AFC01-S14FCA-00; JLCPCB Part Class: Extended Part; LCSC Part Name: 间距:0.5mm P数:14P 翻盖式 下接; Supplier Footprint: SMD,P=0.5mm,卧贴; Datasheet: https://atta.szlcsc.com/upload/public/pdf/source/20190816/C413942_2A72D1AC756EAE17EEDF756A339D4500.pdf; Convert to PCB: yes; Contact Type: Bottom Contact; Mounting Type: 卧贴; Height Above Board: 2mm; Operating Temperature Range: -
U1-U3 = XL-1010RGBC-WS2812B: Manufacturer: XINGLIGHT(成兴光); Add into BOM: yes; Symbol: XL-1010RGBC-WS2812B; Device: XL-1010RGBC-WS2812B; LCSC Part Name: XL-1010RGBC-WS2812B; Supplier Part: C5349953; Manufacturer Part: XL-1010RGBC-WS2812B; Supplier Footprint: SMD,1x1mm; JLCPCB Part Class: Extended Part; Datasheet: https://atta.szlcsc.com/upload/public/pdf/source/20240218/17D2BD8F4295D202E0F5662BF6E5539A.pdf; Supplier: LCSC; Convert to PCB: yes
U5 = LSM6DS3TR-C: Manufacturer: ST(意法半导体); Add into BOM: yes; Sensor Type: Accelerometer gyroscope; Symbol: LSM6DS3TR-C; Device: LSM6DS3TR-C; LCSC Part Name: IMU-惯性测量单元; Supplier Part: C967633; Manufacturer Part: LSM6DS3TR-C; Supplier Footprint: LGA-14(2.5x3); JLCPCB Part Class: Extended Part; Datasheet: https://atta.szlcsc.com/upload/public/pdf/source/20210226/C967633_4D8B3A108D63359423D57B97CE5134B1.pdf; Supplier: LCSC; Convert to PCB: yes; Operating Temperature: -40℃~+85℃
U6 = TP4054-42-SOT25R: Manufacturer: TOPPOWER(南京拓微); Symbol: TP4054; Add into BOM: yes; Device: TP4054-42-SOT25R; LCSC Part Name: TP4054-42-SOT25R; Supplier Part: C32574; Manufacturer Part: TP4054-42-SOT25R; Supplier Footprint: SOT-23-5; JLCPCB Part Class: Extended Part; Datasheet: https://atta.szlcsc.com/upload/public/pdf/source/20140621/1457707095588.pdf; Supplier: LCSC; Convert to PCB: yes
U8 = S2B-PH-K(LF)(SN): Manufacturer: JST; Add into BOM: yes; Pins Structure: 1x2P; Pitch: 2mm; Reference Series: PH; Number of PINs Per Row: 2; Current Rating (Max): 2A; Rated Voltage (Max): 100V; Plastic Material: PA66; Flame Retardant Rating: UL94V-0; Supplementary Features: 打K脚; Z-Height of the Board: 4.8mm; X-Length of Bottom Edge on Board (Spacing Line): 5.9mm; Y-Width of Bottom Edge on Board: 7.6mm; Symbol: S2B-PH-K(LF)(SN); Device: S2B-PH-K(LF)(SN); LCSC Part Name: 1x2P 间距:2mm 弯插 系列:PH; Supplier Part: C265016; Manufacturer Part: S2B-PH-K(LF)(SN); Supplier Footprint: 弯插,P=2mm; JLCPCB Part Class: Extended Part; Datasheet: https://atta.szlcsc.com/upload/public/pdf/source/20181010/C265101_22107ACC4D8714694FDA2DD97145FA81.pdf; Supplier: LCSC; Convert to PCB: yes; Mounting Style: Right-Angle; Number of Pins: 2P; Number of Rows: 1; Row Spacing: -; Contact Material: Brass; Contact Plating: Tin; Operating Temperature Range: -25℃~+85℃; Colour: White
U9 = CP2102-GMR: Manufacturer: SILICON LABS(芯科); Add into BOM: yes; Protocol: USB; Number of Drivers/Receivers: 1/1; Data Rate: 1Mbps; Supply Voltage: 3V ~ 3.6V; Symbol: CP2102-GMR; Device: CP2102-GMR; LCSC Part Name: CP2102-GMR; Supplier Part: C6568; Manufacturer Part: CP2102-GMR; Supplier Footprint: QFN-28_5x5x05P; JLCPCB Part Class: Basic Part; Datasheet: https://atta.szlcsc.com/upload/public/pdf/source/20170103/1483439882795.pdf; Supplier: LCSC; Convert to PCB: yes; Type: Transceiver
U14 = MAX17048G+T10: Manufacturer: ADI(亚德诺)/MAXIM(美信); Add into BOM: yes; The Chip Type: 电池监测芯片; Type of Battery: 锂离子/Polymer; Number of Cells: 1; Symbol: MAX17048G+T10; Device: MAX17048G+T10; LCSC Part Name: MAX17048G+T10; Supplier Part: C2682616; Manufacturer Part: MAX17048G+T10; Supplier Footprint: DFN-8-EP(2x2); JLCPCB Part Class: Extended Part; Datasheet: https://atta.szlcsc.com/upload/public/pdf/source/20210106/C2682616_818568B5D3BA4B627110FCAA33E0BFB1.pdf; Supplier: LCSC; Convert to PCB: yes; Operating Temperature: -20℃~+70℃
U15 = ESP32-S3-WROOM-1-N16R8: Manufacturer: ESPRESSIF(乐鑫); Symbol: ESP32-S3-WROOM-1(N16R8); Add into BOM: yes; Device: ESP32-S3-WROOM-1-N16R8; LCSC Part Name: 通用型Wi-Fi+低功耗蓝牙MCU模组; Supplier Part: C2913202; Manufacturer Part: ESP32-S3-WROOM-1-N16R8; Supplier Footprint: SMD,18x25.5mm; JLCPCB Part Class: Extended Part; Datasheet: https://atta.szlcsc.com/upload/public/pdf/source/20241030/6A412B13087E1327DF6279F5735253CA.pdf; Supplier: LCSC; Convert to PCB: yes
U16 = AT24C04C-SSHM-T: Manufacturer: MICROCHIP(美国微芯); Add into BOM: yes; Interface: I2C; Memory Size: 4Kbit; Clock Frequency: 1MHz; Voltage - Supply: 1.7V~5.5V; Write Cycle Time(Tw): 5ms; Data Retention - TDR (Year): 100 Years; Write Cycle Endurance: 1,000,000 Cycles; Symbol: AT24C04C-SSHM-T; Device: AT24C04C-SSHM-T; LCSC Part Name: 支持I²C接口的串行EEPROM; Supplier Part: C6205; Manufacturer Part: AT24C04C-SSHM-T; Supplier Footprint: SOIC-8; JLCPCB Part Class: Extended Part; Datasheet: https://item.szlcsc.com/datasheet/AT24C04C-SSHM-T/6671.html; Supplier: LCSC; Convert to PCB: yes; Operating Temperature: -40℃~+85℃
US_L US_M_1 US_M_2 US_R = TC-6610-9-260G: Manufacturer: HCTL(华灿天禄); Add into BOM: yes; Circuit: SPST; Actuator Style: Round Button; Operating Force: 260gf; Switch Height: 9mm; Strike Gundam: Without bracket; Contact Current: 50mA; Voltage Rating: 12V; Actuator/Cap Color: Black; With Lamp: None; Life: 100000 Times; Symbol: TC-6610-9-260G; Device: TC-6610-9-260G; LCSC Part Name: 6*6*9mm 插件 轻触开关; Supplier Part: C2845257; Manufacturer Part: TC-6610-9-260G; Supplier Footprint: 插件; JLCPCB Part Class: Extended Part; Datasheet: https://atta.szlcsc.com/upload/public/pdf/source/20230323/2FDB5D6FCE87B7593CD3E5FAC75F65D7.pdf; Supplier: LCSC; Convert to PCB: yes; Mounting Type: Direct Insert; Length: 6mm; Width: 6mm; IP Rating: -; Termination Style: PCPin; Operating Temperature: -25℃~+85℃
USBC1 = TYPE-C-31-M-12: Manufacturer: 韩国韩荣; Add into BOM: yes; Connector Type: Type-C; Gender: Female; Number of Contacts: 16P; Number of Ports: 1; Current Rating - Power (Max): 5A; Symbol: TYPE-C-31-M-12; Device: TYPE-C-31-M-12; LCSC Part Name: Type-C 母; Supplier Part: C165948; Manufacturer Part: TYPE-C-31-M-12; Supplier Footprint: SMD; JLCPCB Part Class: Extended Part; Datasheet: https://atta.szlcsc.com/upload/public/pdf/source/20220525/466408E853115E789EDB0DDC29077C05.pdf; Supplier: LCSC; Convert to PCB: yes; Standard: -; Mounting Style: -; Operating Temperature Range: -